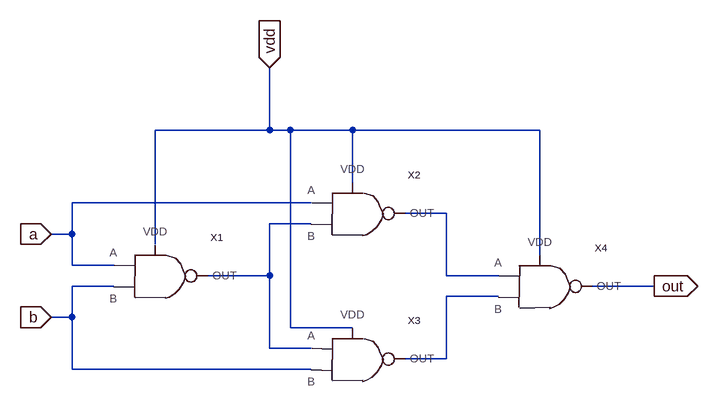
[diagram p0: schematic xor.asc]
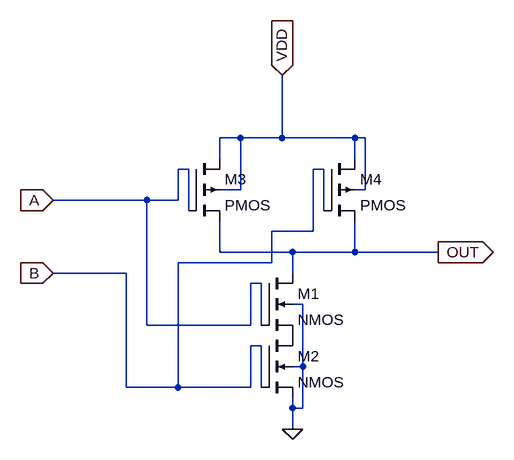
[diagram p1: sub-circuit nand.asc]
xor.asc, the LTspice schematic file:
Version 4
SHEET 1 1104 680
WIRE 416 -112 416 -208
WIRE 416 -112 240 -112
WIRE 448 -112 416 -112
WIRE 544 -112 448 -112
WIRE 832 -112 544 -112
WIRE 544 -32 544 -112
WIRE 480 0 112 0
WIRE 688 16 624 16
WIRE 480 32 416 32
WIRE 112 48 112 0
WIRE 112 48 80 48
WIRE 240 64 240 -112
WIRE 832 80 832 -112
WIRE 112 96 112 48
WIRE 176 96 112 96
WIRE 416 112 416 32
WIRE 416 112 320 112
WIRE 688 112 688 16
WIRE 768 112 688 112
WIRE 176 128 112 128
WIRE 1008 128 912 128
WIRE 768 144 688 144
WIRE 112 176 112 128
WIRE 112 176 80 176
WIRE 448 192 448 -112
WIRE 544 192 448 192
WIRE 416 224 416 112
WIRE 480 224 416 224
WIRE 688 240 688 144
WIRE 688 240 624 240
WIRE 112 256 112 176
WIRE 480 256 112 256
FLAG 80 48 a
IOPIN 80 48 In
FLAG 80 176 b
IOPIN 80 176 In
FLAG 1008 128 out
IOPIN 1008 128 Out
FLAG 416 -208 vdd
IOPIN 416 -208 In
SYMBOL nand 240 112 R0
SYMATTR InstName X1
SYMBOL nand 544 16 R0
SYMATTR InstName X2
SYMBOL nand 544 240 R0
SYMATTR InstName X3
SYMBOL nand 832 128 R0
SYMATTR InstName X4

nand.asc, the sub-circuit schematic file:
Version 4
SHEET 1 880 680
WIRE 144 -80 112 -80
WIRE 208 -80 208 -176
WIRE 208 -80 144 -80
WIRE 320 -80 208 -80
WIRE 336 -80 320 -80
WIRE 112 -48 112 -80
WIRE 320 -48 320 -80
WIRE 64 -32 48 -32
WIRE 272 -32 256 -32
WIRE 144 0 144 -80
WIRE 144 0 112 0
WIRE 336 0 336 -80
WIRE 336 0 320 0
WIRE 0 16 -144 16
WIRE 48 16 48 -32
WIRE 48 16 0 16
WIRE 64 32 64 -32
WIRE 272 32 272 -32
WIRE 256 64 256 -32
WIRE 256 64 192 64
WIRE 112 96 112 48
WIRE 224 96 112 96
WIRE 320 96 320 48
WIRE 320 96 224 96
WIRE 448 96 320 96
WIRE 192 112 192 64
WIRE 192 112 48 112
WIRE -32 128 -144 128
WIRE 224 128 224 96
WIRE 176 144 160 144
WIRE 240 176 224 176
WIRE 0 208 0 16
WIRE 160 208 160 144
WIRE 160 208 0 208
WIRE 176 208 176 144
WIRE 176 240 160 240
WIRE 240 272 240 176
WIRE 240 272 224 272
WIRE -32 304 -32 128
WIRE 48 304 48 112
WIRE 48 304 -32 304
WIRE 160 304 160 240
WIRE 160 304 48 304
WIRE 176 304 176 240
WIRE 224 336 224 320
WIRE 240 336 240 272
WIRE 240 336 224 336
WIRE 224 368 224 336
FLAG 224 368 0
FLAG 448 96 OUT
IOPIN 448 96 Out
FLAG -144 16 A
IOPIN -144 16 In
FLAG -144 128 B
IOPIN -144 128 In
FLAG 208 -176 VDD
IOPIN 208 -176 In
SYMBOL nmos4 176 128 R0
SYMATTR InstName M1
SYMATTR Value2 l=90n w=200n
SYMBOL nmos4 176 224 R0
SYMATTR InstName M2
SYMATTR Value2 l=90n w=200n
SYMBOL pmos4 64 -48 R0
SYMATTR InstName M3
SYMATTR Value2 l=90n w=400n
SYMBOL pmos4 272 -48 R0
SYMATTR InstName M4
SYMATTR Value2 l=90n w=400n

The netlist it stands for:
* xor.asc
XX1 a b N002 vdd nand
XX2 a N002 N001 vdd nand
XX3 N002 b N003 vdd nand
XX4 N001 N003 out vdd nand

* block symbol definitions
.subckt nand A B OUT VDD
M1 OUT A P001 0 NMOS l=90n w=200n
M2 P001 B 0 0 NMOS l=90n w=200n
M3 VDD A OUT VDD PMOS l=90n w=400n
M4 VDD B OUT VDD PMOS l=90n w=400n
.ends nand

.model NMOS NMOS
.model PMOS PMOS
.lib standard.mos
.backanno
.end